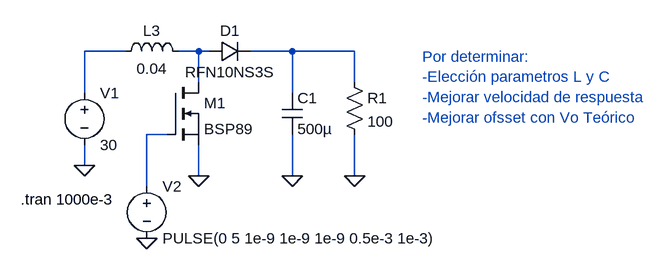
[diagram p0: schematic Boost Converter.asc]
Boost Converter.asc, the LTspice schematic file:
Version 4
SHEET 1 1104 680
WIRE 272 32 208 32
WIRE 384 32 352 32
WIRE 400 32 384 32
WIRE 528 32 464 32
WIRE 624 32 528 32
WIRE 384 80 384 32
WIRE 624 80 624 32
WIRE 208 96 208 32
WIRE 528 96 528 32
WIRE 336 160 304 160
WIRE 208 208 208 176
WIRE 384 224 384 176
WIRE 528 224 528 160
WIRE 624 224 624 160
WIRE 304 240 304 160
FLAG 208 208 0
FLAG 384 224 0
FLAG 528 224 0
FLAG 624 224 0
FLAG 304 320 0
SYMBOL ind 256 48 R270
WINDOW 0 32 56 VTop 2
WINDOW 3 5 56 VBottom 2
SYMATTR InstName L3
SYMATTR Value 0.04
SYMBOL diode 400 48 R270
WINDOW 0 32 32 VTop 2
WINDOW 3 0 32 VBottom 2
SYMATTR InstName D1
SYMATTR Value RFN10NS3S
SYMBOL nmos 336 80 R0
SYMATTR InstName M1
SYMATTR Value BSP89
SYMBOL cap 512 96 R0
SYMATTR InstName C1
SYMATTR Value 500µ
SYMBOL res 608 64 R0
SYMATTR InstName R1
SYMATTR Value 100
SYMBOL voltage 304 224 R0
WINDOW 123 0 0 Left 0
WINDOW 39 0 0 Left 0
SYMATTR InstName V2
SYMATTR Value PULSE(0 5 1e-9 1e-9 1e-9 0.5e-3 1e-3)
SYMBOL voltage 208 80 R0
WINDOW 123 0 0 Left 0
WINDOW 39 0 0 Left 0
SYMATTR InstName V1
SYMATTR Value 30
TEXT 110 260 Left 2 !.tran 1000e-3
TEXT 728 40 Left 2 ;Por determinar:\n-Elección parametros L y C\n-Mejorar velocidad de respuesta\n-Mejorar ofsset con Vo Teórico

The netlist it stands for:
* Boost Converter.asc
L3 N001 N002 0.04
D1 N002 N003 RFN10NS3S
M1 N002 N004 0 0 BSP89
C1 N003 0 500µ
R1 N003 0 100
V2 N004 0 PULSE(0 5 1e-9 1e-9 1e-9 0.5e-3 1e-3)
V1 N001 0 30
.model D D
.lib standard.dio
.model NMOS NMOS
.model PMOS PMOS
.lib standard.mos
.tran 1000e-3
* Por determinar:
* -Elección parametros L y C
* -Mejorar velocidad de respuesta
* -Mejorar ofsset con Vo Teórico
.backanno
.end